# Altium schematic sheet LED_Controller_UART_Multiplexer.SchDoc
size A4
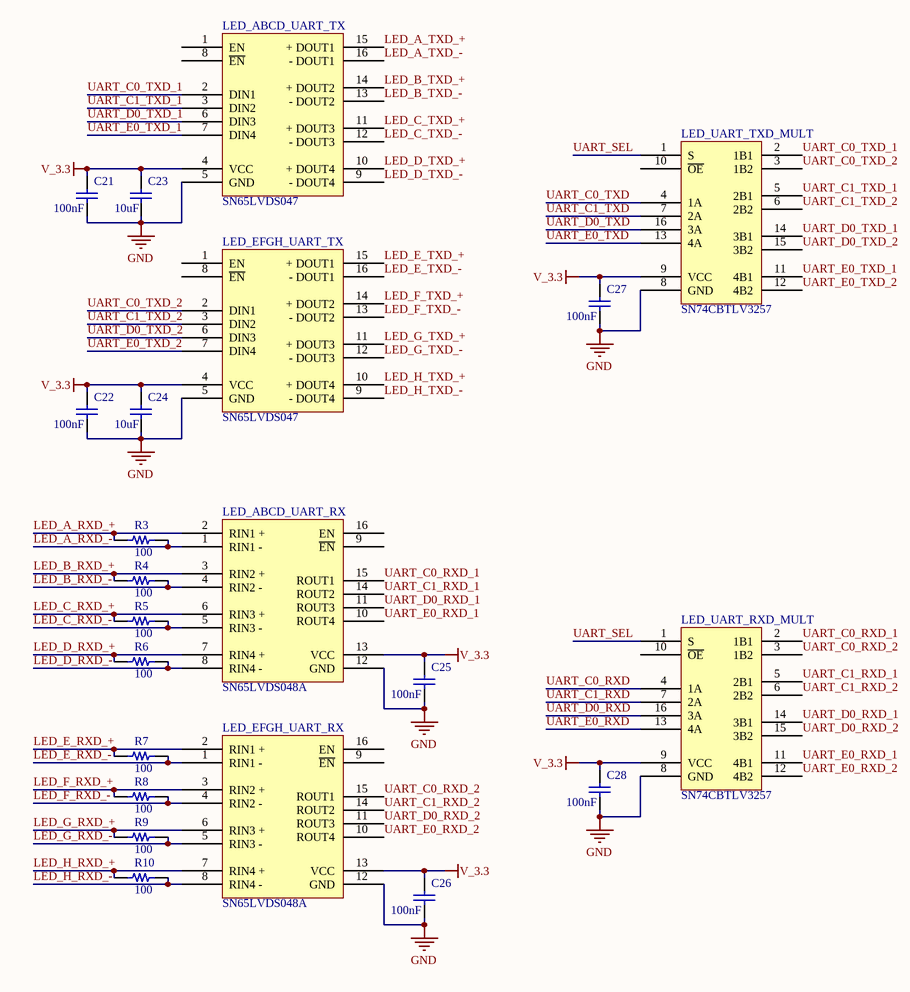
[diagram p0: LED_Controller_UART_Multiplexer.SchDoc]

## Parts
C21  100nF  [0603]
C22  100nF  [0603]
C23  10uF  [0603]
C24  10uF  [0603]
C25  100nF  [0603]
C26  100nF  [0603]
C27  100nF  [0603]
C28  100nF  [0603]
LED_ABCD_UART_RX  SN65LVDS048A  [TI - PW / TSOP65P640X120-16N]
LED_ABCD_UART_TX  SN65LVDS047  [TI - PW / TSOP65P640X120-16N]
LED_EFGH_UART_RX  SN65LVDS048A  [TI - PW / TSOP65P640X120-16N]
LED_EFGH_UART_TX  SN65LVDS047  [TI - PW / TSOP65P640X120-16N]
LED_UART_RXD_MULT  SN74CBTLV3257  [TI - DGV16 / TSSOP40P640X120-16N]
LED_UART_TXD_MULT  SN74CBTLV3257  [TI - DGV16 / TSSOP40P640X120-16N]
R3  100  [0603]
R4  100  [0603]
R5  100  [0603]
R6  100  [0603]
R7  100  [0603]
R8  100  [0603]
R9  100  [0603]
R10  100  [0603]

## Nets
GND: C21.1 C22.1 C23.1 C24.1 C25.1 C26.1 C27.1 C28.1 LED_ABCD_UART_RX.12(GND) LED_ABCD_UART_TX.5(GND) LED_EFGH_UART_RX.12(GND) LED_EFGH_UART_TX.5(GND) LED_UART_RXD_MULT.8(GND) LED_UART_TXD_MULT.8(GND)
V_3.3: C21.2 C22.2 C23.2 C24.2 C25.2 C26.2 C27.2 C28.2 LED_ABCD_UART_RX.13(VCC) LED_ABCD_UART_TX.4(VCC) LED_EFGH_UART_RX.13(VCC) LED_EFGH_UART_TX.4(VCC) LED_UART_RXD_MULT.9(VCC) LED_UART_TXD_MULT.9(VCC)
LED_A_RXD_+: LED_ABCD_UART_RX.2(RIN1_+) R3.1
LED_A_RXD_-: LED_ABCD_UART_RX.1(RIN1_-) R3.2
LED_A_TXD_+: LED_ABCD_UART_TX.15(+_DOUT1)
LED_A_TXD_-: LED_ABCD_UART_TX.16(-_DOUT1)
LED_B_RXD_+: LED_ABCD_UART_RX.3(RIN2_+) R4.1
LED_B_RXD_-: LED_ABCD_UART_RX.4(RIN2_-) R4.2
LED_B_TXD_+: LED_ABCD_UART_TX.14(+_DOUT2)
LED_B_TXD_-: LED_ABCD_UART_TX.13(-_DOUT2)
LED_C_RXD_+: LED_ABCD_UART_RX.6(RIN3_+) R5.1
LED_C_RXD_-: LED_ABCD_UART_RX.5(RIN3_-) R5.2
LED_C_TXD_+: LED_ABCD_UART_TX.11(+_DOUT3)
LED_C_TXD_-: LED_ABCD_UART_TX.12(-_DOUT3)
LED_D_RXD_+: LED_ABCD_UART_RX.7(RIN4_+) R6.1
LED_D_RXD_-: LED_ABCD_UART_RX.8(RIN4_-) R6.2
LED_D_TXD_+: LED_ABCD_UART_TX.10(+_DOUT4)
LED_D_TXD_-: LED_ABCD_UART_TX.9(-_DOUT4)
LED_E_RXD_+: LED_EFGH_UART_RX.2(RIN1_+) R7.1
LED_E_RXD_-: LED_EFGH_UART_RX.1(RIN1_-) R7.2
LED_E_TXD_+: LED_EFGH_UART_TX.15(+_DOUT1)
LED_E_TXD_-: LED_EFGH_UART_TX.16(-_DOUT1)
LED_F_RXD_+: LED_EFGH_UART_RX.3(RIN2_+) R8.1
LED_F_RXD_-: LED_EFGH_UART_RX.4(RIN2_-) R8.2
LED_F_TXD_+: LED_EFGH_UART_TX.14(+_DOUT2)
LED_F_TXD_-: LED_EFGH_UART_TX.13(-_DOUT2)
LED_G_RXD_+: LED_EFGH_UART_RX.6(RIN3_+) R9.1
LED_G_RXD_-: LED_EFGH_UART_RX.5(RIN3_-) R9.2
LED_G_TXD_+: LED_EFGH_UART_TX.11(+_DOUT3)
LED_G_TXD_-: LED_EFGH_UART_TX.12(-_DOUT3)
LED_H_RXD_+: LED_EFGH_UART_RX.7(RIN4_+) R10.1
LED_H_RXD_-: LED_EFGH_UART_RX.8(RIN4_-) R10.2
LED_H_TXD_+: LED_EFGH_UART_TX.10(+_DOUT4)
LED_H_TXD_-: LED_EFGH_UART_TX.9(-_DOUT4)
UART_C0_RXD: LED_UART_RXD_MULT.4(1A)
UART_C0_RXD_1: LED_ABCD_UART_RX.15(ROUT1) LED_UART_RXD_MULT.2(1B1)
UART_C0_RXD_2: LED_EFGH_UART_RX.15(ROUT1) LED_UART_RXD_MULT.3(1B2)
UART_C0_TXD: LED_UART_TXD_MULT.4(1A)
UART_C0_TXD_1: LED_ABCD_UART_TX.2(DIN1) LED_UART_TXD_MULT.2(1B1)
UART_C0_TXD_2: LED_EFGH_UART_TX.2(DIN1) LED_UART_TXD_MULT.3(1B2)
UART_C1_RXD: LED_UART_RXD_MULT.7(2A)
UART_C1_RXD_1: LED_ABCD_UART_RX.14(ROUT2) LED_UART_RXD_MULT.5(2B1)
UART_C1_RXD_2: LED_EFGH_UART_RX.14(ROUT2) LED_UART_RXD_MULT.6(2B2)
UART_C1_TXD: LED_UART_TXD_MULT.7(2A)
UART_C1_TXD_1: LED_ABCD_UART_TX.3(DIN2) LED_UART_TXD_MULT.5(2B1)
UART_C1_TXD_2: LED_EFGH_UART_TX.3(DIN2) LED_UART_TXD_MULT.6(2B2)
UART_D0_RXD: LED_UART_RXD_MULT.16(3A)
UART_D0_RXD_1: LED_ABCD_UART_RX.11(ROUT3) LED_UART_RXD_MULT.14(3B1)
UART_D0_RXD_2: LED_EFGH_UART_RX.11(ROUT3) LED_UART_RXD_MULT.15(3B2)
UART_D0_TXD: LED_UART_TXD_MULT.16(3A)
UART_D0_TXD_1: LED_ABCD_UART_TX.6(DIN3) LED_UART_TXD_MULT.14(3B1)
UART_D0_TXD_2: LED_EFGH_UART_TX.6(DIN3) LED_UART_TXD_MULT.15(3B2)
UART_E0_RXD: LED_UART_RXD_MULT.13(4A)
UART_E0_RXD_1: LED_ABCD_UART_RX.10(ROUT4) LED_UART_RXD_MULT.11(4B1)
UART_E0_RXD_2: LED_EFGH_UART_RX.10(ROUT4) LED_UART_RXD_MULT.12(4B2)
UART_E0_TXD: LED_UART_TXD_MULT.13(4A)
UART_E0_TXD_1: LED_ABCD_UART_TX.7(DIN4) LED_UART_TXD_MULT.11(4B1)
UART_E0_TXD_2: LED_EFGH_UART_TX.7(DIN4) LED_UART_TXD_MULT.12(4B2)
UART_SEL: LED_UART_RXD_MULT.1(S) LED_UART_TXD_MULT.1(S)

Not connected (* = marked no-connect by the designer): LED_ABCD_UART_RX 9(~{EN}) 16(EN); LED_ABCD_UART_TX 1(EN) 8(~{EN}); LED_EFGH_UART_RX 9(~{EN}) 16(EN); LED_EFGH_UART_TX 1(EN) 8(~{EN}); LED_UART_RXD_MULT 10(~{OE}); LED_UART_TXD_MULT 10(~{OE})

## Library data of the parts
C21 C22 C25-C28 = CP - 100nF 0603: CAP CER .10UF 50V X5R 0603; Manufacturer: AVX Corporation; Manufacturer Part Number: 06035D104KAT2A; Capacitance: 0.1µF; Tolerance: ±10%; Supplier 1: Digi-Key; RoHS: RoHS Compliant; Category: Capacitors; Stock 1: 0; Pricing 1: 10=0.33, 100=0.195, 500=0.1125, 1000=0.078 (USD); Voltage - Rated: 50V; Temperature Coefficient: X5R; Mounting Type: Surface Mount, MLCC; Operating Temperature: -55°C ~ 85°C; Applications: General Purpose; Ratings: -; Package / Case: 0603 (1608 Metric); Size / Dimension: 0.063" L x 0.032" W (1.60mm x 0.81mm); Height: -; Thickness: 0.035" (0.90mm); Lead Spacing: -; Features: -; Packaging: Cut Tape (CT); Lead Style: -; ComponentLink1URL: http://www.avx.com/docs/Catalogs/cx5r.pdf; ComponentLink1Description: http://www.avx.com/docs/Catalogs/cx5r.pdf; Supplier Part Number 1: 478-6206-1-ND
C23 C24 = CP - 10uF 0603: CAP CER 10000PF 50V X7R 0603; Manufacturer: TDK Corporation; Manufacturer Part Number: C1608X7R1H103M; Tolerance: ±20%; Supplier 1: Digi-Key; RoHS: RoHS Compliant; Category: Capacitors; Stock 1: 7957; Pricing 1: 1=0.08, 10=0.05, 100=0.018, 250=0.013, 500=0.0096, 1000=0.0065 (USD); Capacitance: 10000pF; Voltage - Rated: 50V; Temperature Coefficient: X7R; Mounting Type: Surface Mount, MLCC; Operating Temperature: -55°C ~ 125°C; Applications: General Purpose; Ratings: -; Package / Case: 0603 (1608 Metric); Size / Dimension: 0.063" L x 0.031" W (1.60mm x 0.80mm); Height: -; Thickness: 0.037" (0.95mm); Lead Spacing: -; Features: -; Packaging: Cut Tape (CT); Lead Style: -; ComponentLink1URL: http://www.tdk.com/pdf/general_B11.pdf; ComponentLink1Description: http://www.tdk.com/pdf/general_B11.pdf; Supplier Part Number 1: 445-5090-1-ND
LED_ABCD_UART_RX LED_EFGH_UART_RX = IC - SN65LVDS048A: LVDS QUAD DIFFERENTIAL LINE RECEIVER; Supplier 1: Digi-Key; Supplier Part Number 1: 296-6912-5-ND
LED_ABCD_UART_TX LED_EFGH_UART_TX = IC - SN65LVDS047: IC LVDS QUAD LINE DRIVER; Supplier 1: Digi-Key; Supplier Part Number 1: 296-6910-5-ND
LED_UART_RXD_MULT LED_UART_TXD_MULT = IC - SN74CBTLV3257: Low-Voltage 4-Bit 1-of-2 FET Multiplexer/Demultiplexer; Supplier 1: Digi-Key; Supplier Part Number 1: 296-9136-1-ND
R3-R10 = RS - 100 0603: RES 100 OHM 1/10W 1% 0603 SMD; Supplier 1: Digi-Key; Supplier Part Number 1: RMCF0603FT100RCT-ND